# Altium schematic sheet st-link.SchDoc
size A4; SheetNumber: 1; SheetTotal: 1
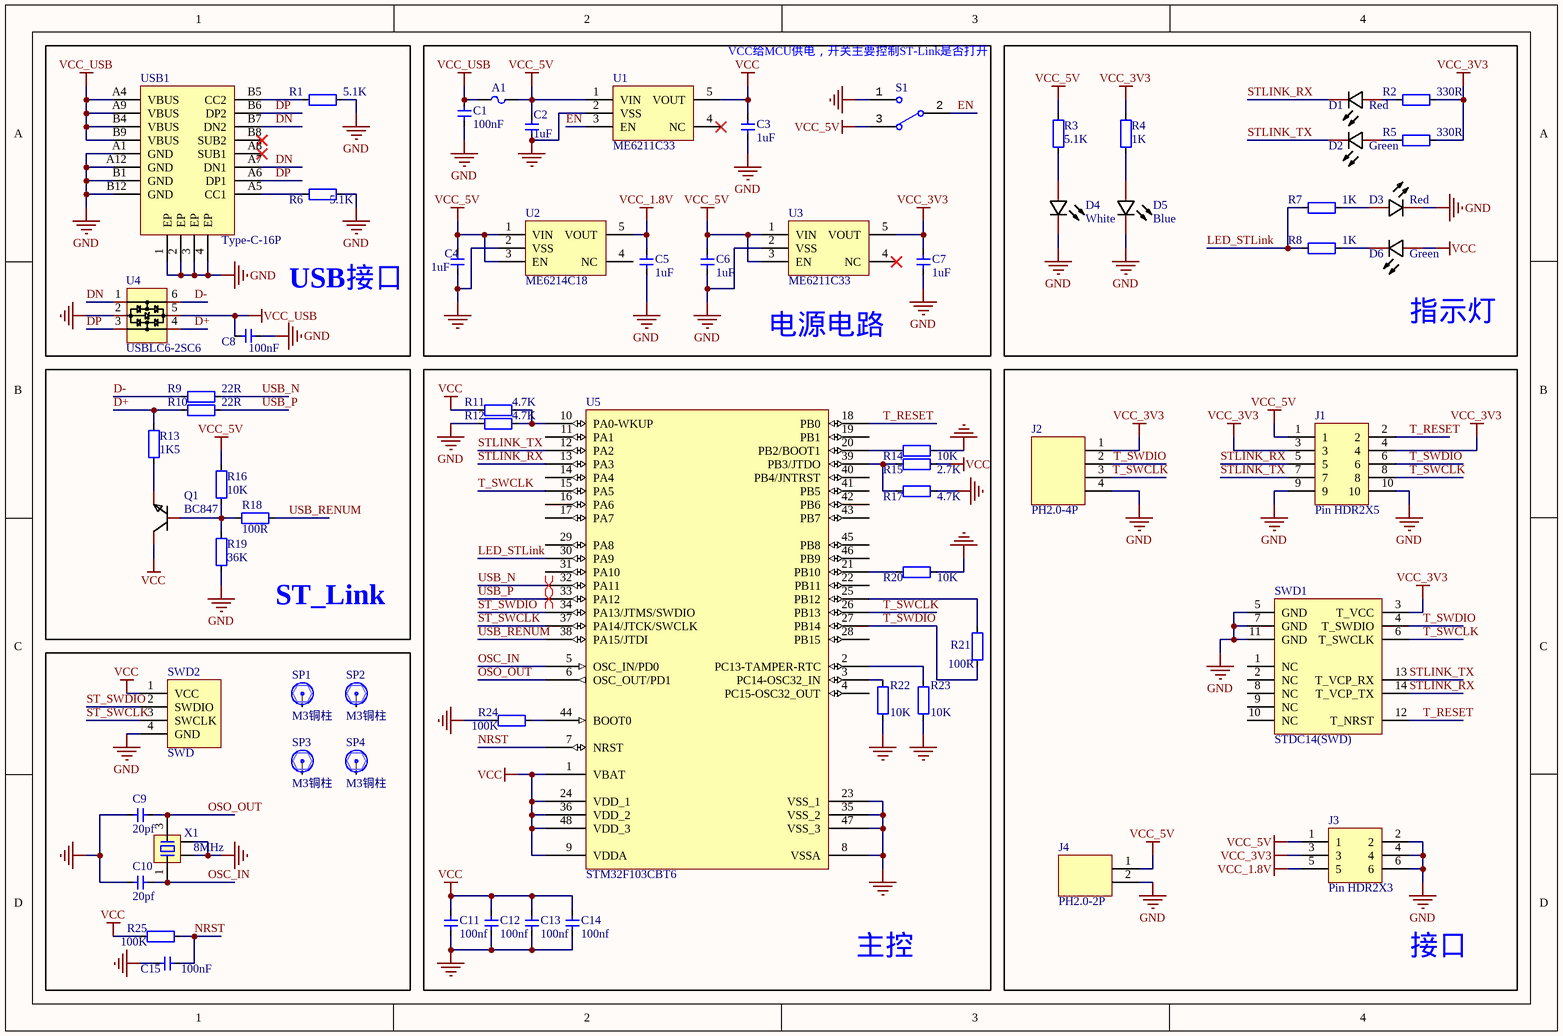
[diagram p0: st-link.SchDoc]

## Parts
A1  ASMD1812-300  [FUSE-1812]  (value not drawn)
C1  100nF  [CAP_0402]
C2  1uF  [CAP_0402]
C3  1uF  [CAP_0402]
C4  1uF  [CAP_0402]
C5  1uF  [CAP_0402]
C6  1uF  [CAP_0402]
C7  1uF  [CAP_0402]
C8  100nF  [CAP_0402]
C9  20pf  [CAP_0402]
C10  20pf  [CAP_0402]
C11  100nf  [CAP_0402]
C12  100nf  [CAP_0402]
C13  100nf  [CAP_0402]
C14  100nf  [CAP_0402]
C15  100nF  [CAP_0402]
D1  Red  [LED-0603G]
D2  Green  [LED-0603G]
D3  Red  [LED-0603G]
D4  White  [LED-0603G]
D5  Blue  [LED-0603G]
D6  Green  [LED-0603G]
J1  Pin HDR2X5  [Pin HDR2X5/2.54mm-S]
J2  PH2.0-4P  [PH2.0-4P]
J3  Pin HDR2X3  [Pin HDR2X3/2.54mm-S]
J4  PH2.0-2P  [PH2.0-2P]
Q1  BC847  [SOT23-3]
R1  5.1K  [RES_0402]
R2  330R  [RES_0402]
R3  5.1K  [RES_0402]
R4  1K  [RES_0402]
R5  330R  [RES_0402]
R6  5.1K  [RES_0402]
R7  1K  [RES_0402]
R8  1K  [RES_0402]
R9  22R  [RES_0402]
R10  22R  [RES_0402]
R11  4.7K  [RES_0402]
R12  4.7K  [RES_0402]
R13  1K5  [RES_0402]
R14  10K  [RES_0402]
R15  2.7K  [RES_0402]
R16  10K  [RES_0402]
R17  4.7K  [RES_0402]
R18  100R  [RES_0402]
R19  36K  [RES_0402]
R20  10K  [RES_0402]
R21  100R  [RES_0402]
R22  10K  [RES_0402]
R23  10K  [RES_0402]
R24  100K  [RES_0402]
R25  100K  [RES_0402]
S1  SPDT 3P  [SwitchSPDT_2.8X6.6_90]  (value not drawn)
SP1  M3铜柱  [铜柱]
SP2  M3铜柱  [铜柱]
SP3  M3铜柱  [铜柱]
SP4  M3铜柱  [铜柱]
SWD1  STDC14(SWD)  [STDC14]
SWD2  SWD  [焊点×4]
U1  ME6211C33  [SOT23-5]
U2  ME6214C18  [SOT23-5]
U3  ME6211C33  [SOT23-5]
U4  USBLC6-2SC6  [SOT23-6]
U5  STM32F103CBT6  [LQFP48 7X7]
USB1  Type-C-16P  [USB-C-SMD_KH-TYPE-C-16P]
X1  8MHz  [OSC 3225-4P]

## Blocks framed on the sheet
USB接口: C8 R1 R6 U4 USB1
电源电路: A1 C1-C7 S1 U1-U3
指示灯: D1-D6 R2-R5 R7 R8
ST_Link: Q1 R9 R10 R13 R16 R18 R19
主控: C11-C14 R11 R12 R14 R15 R17 R20-R24 U5
接口: J1-J4 SWD1

## Nets
GND: C1.2 C2.2 C3.2 C4.2 C5.2 C6.2 C7.2 C8.2 C9.1 C10.1 C11.1 C12.1 C13.1 C14.1 C15.1 D3.K(C) D4.K(C) D5.K(C) J1.9 J1.10 J2.4 J3.2 J3.4 J3.6 J4.2 R1.2 R6.2 R12.2 R14.2 R17.2 R19.1 R20.2 R22.2 R23.2 R24.2 S1.1 SWD1.5(GND) SWD1.7(GND) SWD1.11(GND) SWD2.4(GND) U1.2(VSS) U2.2(VSS) U3.2(VSS) U4.2(GND) U5.8(VSSA) U5.23(VSS_1) U5.35(VSS_2) U5.47(VSS_3) USB1.1(EP) USB1.2(EP) USB1.3(EP) USB1.4(EP) USB1.A1(GND) USB1.A12(GND) USB1.B1(GND) USB1.B12(GND) X1.2 X1.4
VCC: C3.1 C11.2 C12.2 C13.2 C14.2 D6.A Q1.3(C) R11.2 R15.2 R25.2 SWD2.1(VCC) U1.5(VOUT) U5.1(VBAT) U5.9(VDDA) U5.24(VDD_1) U5.36(VDD_2) U5.48(VDD_3)
VCC_1.8V: C5.1 J3.5 U2.5(VOUT)
VCC_3V3: C7.1 J1.3 J1.4 J2.1 J3.3 R2.2 R4.1 R5.2 SWD1.3(T_VCC) U3.5(VOUT)
VCC_5V: A1.2 C2.1 C4.1 C6.1 J1.1 J3.1 J4.1 R3.1 R16.2 S1.3 U1.1(VIN) U2.1(VIN) U2.3(EN) U3.1(VIN) U3.3(EN)
VCC_USB: A1.1 C1.1 C8.1 U4.5(VBUS) USB1.A4(VBUS) USB1.A9(VBUS) USB1.B4(VBUS) USB1.B9(VBUS)
D+: R10.1 R13.2 U4.4(I/O2)
D-: R9.1 U4.6(I/O1)
DN: U4.1(I/O1) USB1.A7(DN1) USB1.B7(DN2)
DP: U4.3(I/O2) USB1.A6(DP1) USB1.B6(DP2)
EN: S1.2 U1.3(EN)
LED_STLink: R7.1 R8.1 U5.30(PA9)
NRST: C15.2 R25.1 U5.7(NRST)
OSC_IN: C10.2 U5.5(OSC_IN/PD0) X1.1
OSO_OUT: C9.2 U5.6(OSC_OUT/PD1) X1.3
ST_SWCLK: SWD2.3(SWCLK) U5.37(PA14/JTCK/SWCLK)
ST_SWDIO: SWD2.2(SWDIO) U5.34(PA13/JTMS/SWDIO)
STLINK_RX: D1.K(C) J1.5 SWD1.14(T_VCP_TX) U5.13(PA3)
STLINK_TX: D2.K(C) J1.7 SWD1.13(T_VCP_RX) U5.12(PA2)
T_RESET: J1.2 SWD1.12(T_NRST) U5.18(PB0)
T_SWCLK: J1.8 J2.3 SWD1.6(T_SWCLK) U5.15(PA5) U5.26(PB13)
T_SWDIO: J1.6 J2.2 R21.2 SWD1.4(T_SWDIO) U5.27(PB14)
USB_N: R9.2 U5.32(PA11)
USB_P: R10.2 U5.33(PA12)
USB_RENUM: R18.2 U5.38(PA15/JTDI)
NetD1_A: D1.A R2.1
NetD2_A: D2.A R5.1
NetD3_A: D3.A R7.2
NetD4_A: D4.A R3.2
NetD5_A: D5.A R4.2
NetD6_K: D6.K(C) R8.2
NetQ1_1: Q1.1(B) R16.1 R18.1 R19.2
NetQ1_2: Q1.2(E) R13.1
NetR1_1: R1.1 USB1.B5(CC2)
NetR6_1: R6.1 USB1.A5(CC1)
NetR11_1: R11.1 R12.1 U5.10(PA0-WKUP)
NetR14_1: R14.1 U5.20(PB2/BOOT1)
NetR15_1: R15.1 R17.1 U5.39(PB3/JTDO)
NetR20_1: R20.1 U5.21(PB10)
NetR21_1: R21.1 U5.25(PB12)
NetR22_1: R22.1 U5.3(PC14-OSC32_IN)
NetR23_1: R23.1 U5.2(PC13-TAMPER-RTC)
NetR24_1: R24.1 U5.44(BOOT0)

Not connected (* = marked no-connect by the designer): SP1 1; SP2 1; SP3 1; SP4 1; SWD1 1(NC) 2(NC) 8(NC) 9(NC) 10(NC); U1 4(NC)*; U2 4(NC); U3 4(NC)*; U5 4(PC15-OSC32_OUT) 11(PA1) 14(PA4) 16(PA6) 17(PA7) 19(PB1) 22(PB11) 28(PB15) 29(PA8) 31(PA10) 40(PB4/JNTRST) 41(PB5) 42(PB6) 43(PB7) 45(PB8) 46(PB9); USB1 A8(SUB1)* B8(SUB2)*

## Layout directives
differential pair: USB_N, USB_P

## Notes on the sheet
- VCC给MCU供电，开关主要控制ST-Link是否打开

## Library data of the parts
A1 = ASMD1812-300: 3A自恢复保险丝。最大电压：8V 最大电流：100A 保持电流：3A 跳闸电流：5A 消耗功率：800mW 初始态阻值(最小值)：12mΩ 跳断后阻值(最大值)：40mΩ 最大动作时间：4s 工作温度：-40℃~+85℃ 8V , 100A , 3A , 5A , 800mW , 12mΩ , 40mΩ , 4s , -40℃~+85℃ ,
C1-C15 = 电容-0402: Capacitor; Value: 0.1u
D1-D6 = LED0603: 0603LED
Q1 = NPN
R1-R8 R11-R25 = 电阻-0402: Resistor; Value: 22R
R9 R10 = 电阻-0402: Resistor; Value: 22R
S1 = SwitchSPDT_2.8x6.6_90: Switch; Value: SPDT 3P; Type: SPDT
SP1-SP4 = 铜柱: 版权归属: 源创客; BOM名称: 铜柱; 学习资源: www.ooocke.com
SWD1 = STDC14(SWD): For STLINK_V3SET
U1-U3 = ME6211C: 低压差线性稳压器
U4 = USBLC6-2SC6: 静电放电(ESD)保护器件，反向截止电压(Vrwm)：5.25V 击穿电压：6V 峰值脉冲电流(Ipp)：5A@8/20us 最大钳位电压(Vc)@Ipp：17V
U5 = STM32F103C8T6
USB1 = Type-C-16P: C709357
X1 = XTAL-4P: 4脚无源晶振